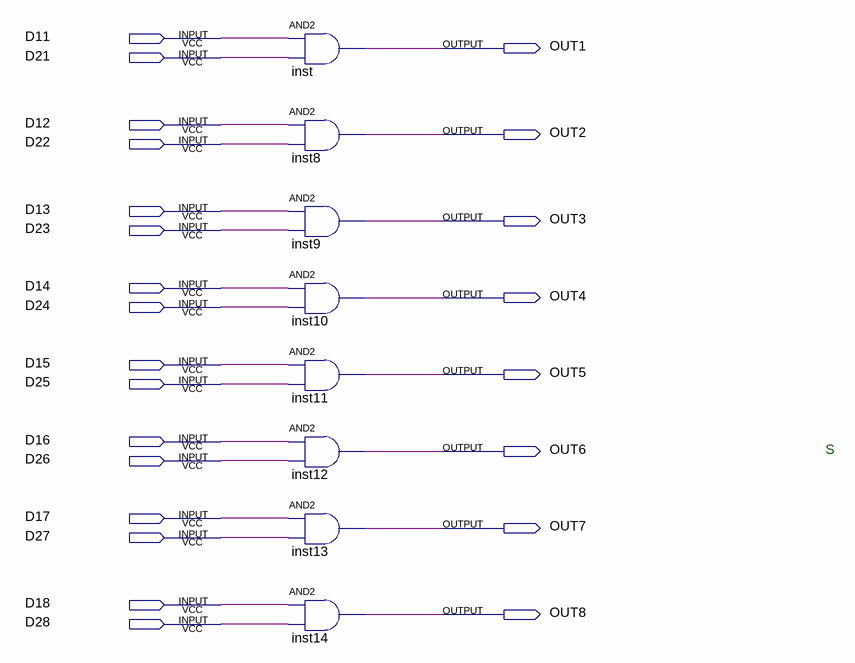
[diagram p0: schematic sheet]
// Quartus schematic AND08.bdf as structural Verilog: 8 symbols, 24 pins
module AND08 (
  input  D11,
  input  D21,
  input  D12,
  input  D22,
  input  D13,
  input  D23,
  input  D14,
  input  D24,
  input  D15,
  input  D25,
  input  D16,
  input  D26,
  input  D17,
  input  D27,
  input  D18,
  input  D28,
  output OUT1,
  output OUT2,
  output OUT3,
  output OUT4,
  output OUT5,
  output OUT6,
  output OUT7,
  output OUT8
);

  and inst (OUT1, D11, D21);
  and inst8 (OUT2, D12, D22);
  and inst9 (OUT3, D13, D23);
  and inst10 (OUT4, D14, D24);
  and inst11 (OUT5, D15, D25);
  and inst12 (OUT6, D16, D26);
  and inst13 (OUT7, D17, D27);
  and inst14 (OUT8, D18, D28);

  // Notes on the sheet:
  //   S
endmodule
